# EAGLE schematic sparkledrive (EAGLE 9.6.0)
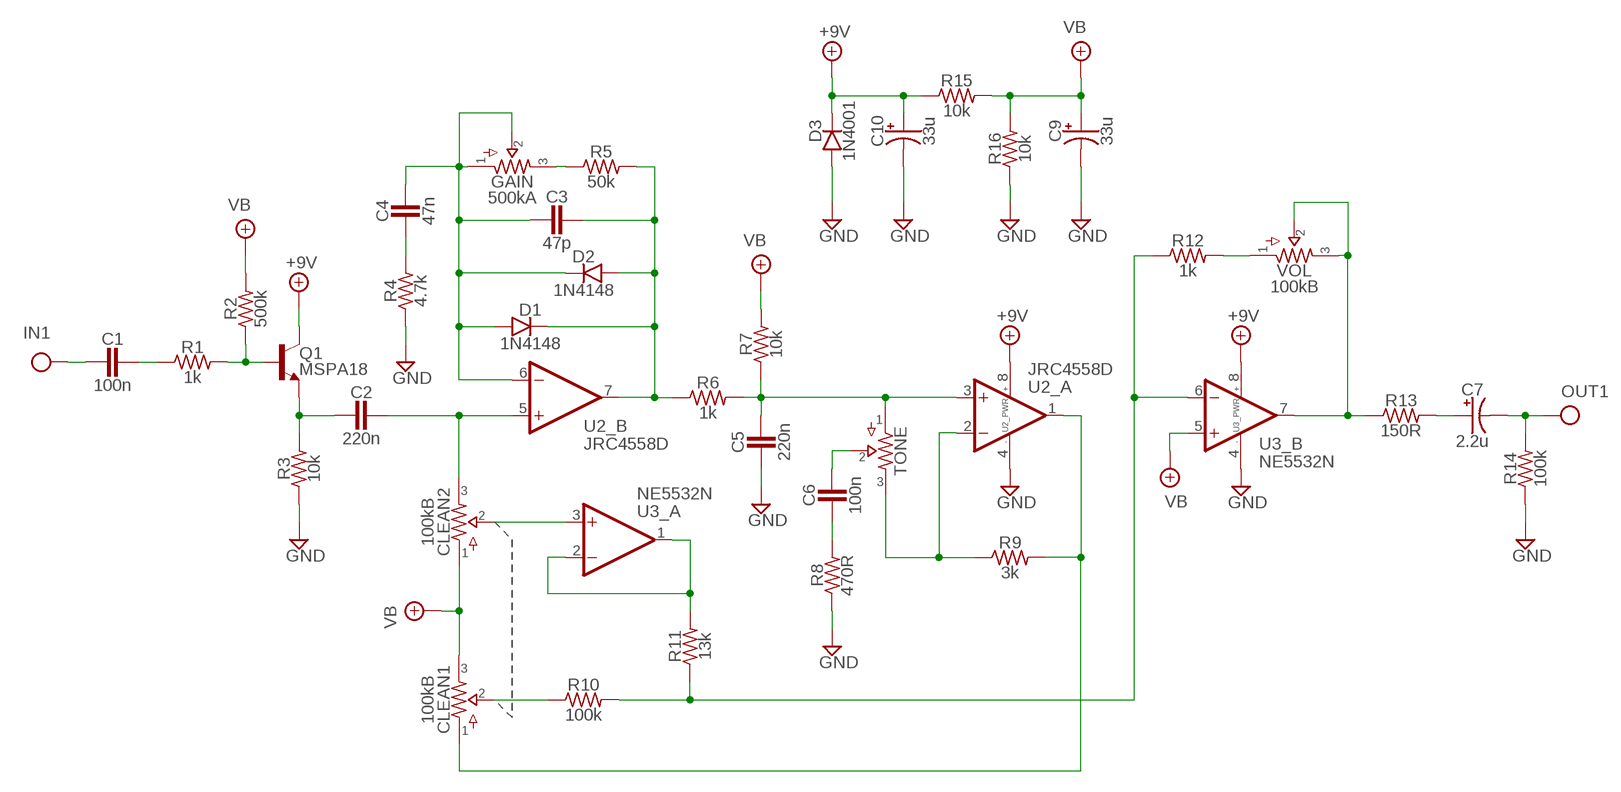
[diagram p0: schematic, sheet 1]

## Parts
C1  100n  CER/FILMBOX.1  [BOX_SMALL]
C2  220n  CER/FILMBOX.1  [BOX_SMALL]
C3  47p  CER/FILMBOX.1  [BOX_SMALL]
C4  47n  CER/FILMBOX.1  [BOX_SMALL]
C5  220n  CER/FILMBOX.1  [BOX_SMALL]
C6  100n  CER/FILMBOX.1  [BOX_SMALL]
C7  2.2u  0500  [050_020]
C9  33u  0500  [050_020]
C10  33u  0500  [050_020]
CLEAN1  100kB  POTS16MM  [16MM]
CLEAN2  100kB  POTS16MM  [16MM]
D1  1N4148  DO35.2  [DO35-2]
D2  1N4148  DO35.2  [DO35-2]
D3  1N4001  DO35.3  [DO35-3]
GAIN  500kA  POTS16MM  [16MM]
Q1  MSPA18  2N3904  [TO92-]
R1  1k  R_.3B  [R0207/3]
R2  500k  R_.3B  [R0207/3]
R3  10k  R_.3B  [R0207/3]
R4  4.7k  R_.3B  [R0207/3]
R5  50k  R_.3B  [R0207/3]
R6  1k  R_.3B  [R0207/3]
R7  10k  R_.3B  [R0207/3]
R8  470R  R_.3B  [R0207/3]
R9  3k  R_.3B  [R0207/3]
R10  100k  R_.3B  [R0207/3]
R11  13k  R_.3B  [R0207/3]
R12  1k  R_.3B  [R0207/3]
R13  150R  R_.3B  [R0207/3]
R14  100k  R_.3B  [R0207/3]
R15  10k  R_.3B  [R0207/3]
R16  10k  R_.3B  [R0207/3]
TONE  POTS16MM  [16MM]
U2  JRC4558D  DUALTH  [DIL0]
U3  NE5532N  DUALTH  [DIL0]
VOL  100kB  POTS16MM  [16MM]

## Nets
+9V: C10.+ D3.C Q1.1(C) R15.1 U2.8(_PWR:V+) U3.8(_PWR:V+)
GND: C5.2 C9.- C10.- D3.A R3.1 R4.1 R8.1 R14.1 R16.1 U2.4(_PWR:V-) U3.4(_PWR:V-)
IN: C1.2
N$1: C3.2 C4.1 D1.A D2.C GAIN.1 GAIN.2 U2.6(_B:-IN)
N$2: C4.2 R4.2
N$3: GAIN.3 R5.1
N$4: C3.1 D1.C D2.A R5.2 R6.1 U2.7(_B:OUT)
N$5: C2.1 CLEAN2.3 U2.5(_B:+IN)
N$6: C2.2 Q1.3(E) R3.2
N$8: C1.1 R1.1
N$9: Q1.2(B) R1.2 R2.1
N$12: CLEAN1.2 R10.1
N$13: R11.2 U3.1(_A:OUT) U3.2(_A:-IN)
N$14: R9.1 TONE.3 U2.2(_A:-IN)
N$15: R10.2 R11.1 R12.1 U3.6(_B:-IN)
N$17: CLEAN1.1 R9.2 U2.1(_A:OUT)
N$18: CLEAN2.2 U3.3(_A:+IN)
N$19: C5.1 R6.2 R7.1 TONE.1 U2.3(_A:+IN)
N$21: C6.1 TONE.2
N$22: C6.2 R8.2
N$24: R12.2 VOL.1
N$25: R13.1 U3.7(_B:OUT) VOL.2 VOL.3
N$28: C7.+ R13.2
OUT: C7.- R14.2
VB: C9.+ CLEAN1.3 CLEAN2.1 R2.2 R7.2 R15.2 R16.2 U3.5(_B:+IN)

## Library data of the parts
C1-C6 = pedals-capacitors-film:CER/FILM: 47 - 120pF Xicon Ceramic Disc 2.5mm lead spacing
C7 C9 C10 = pedals-capacitors-elec:050
CLEAN1 CLEAN2 GAIN TONE VOL = pedals-potentiometers:POTS
D1-D3 = pedals-diodes:DO35: DO-35 Package Diodes: 1N914
Q1 = pedals-transistors:2N3904: NPN Transistor
R1-R16 = pedals-resistors:R_
U2 U3 = pedals-integrated circuits:DUAL: OP AMP